# EAGLE schematic BrushlessMotorControllerL293D (EAGLE 9.6.2)
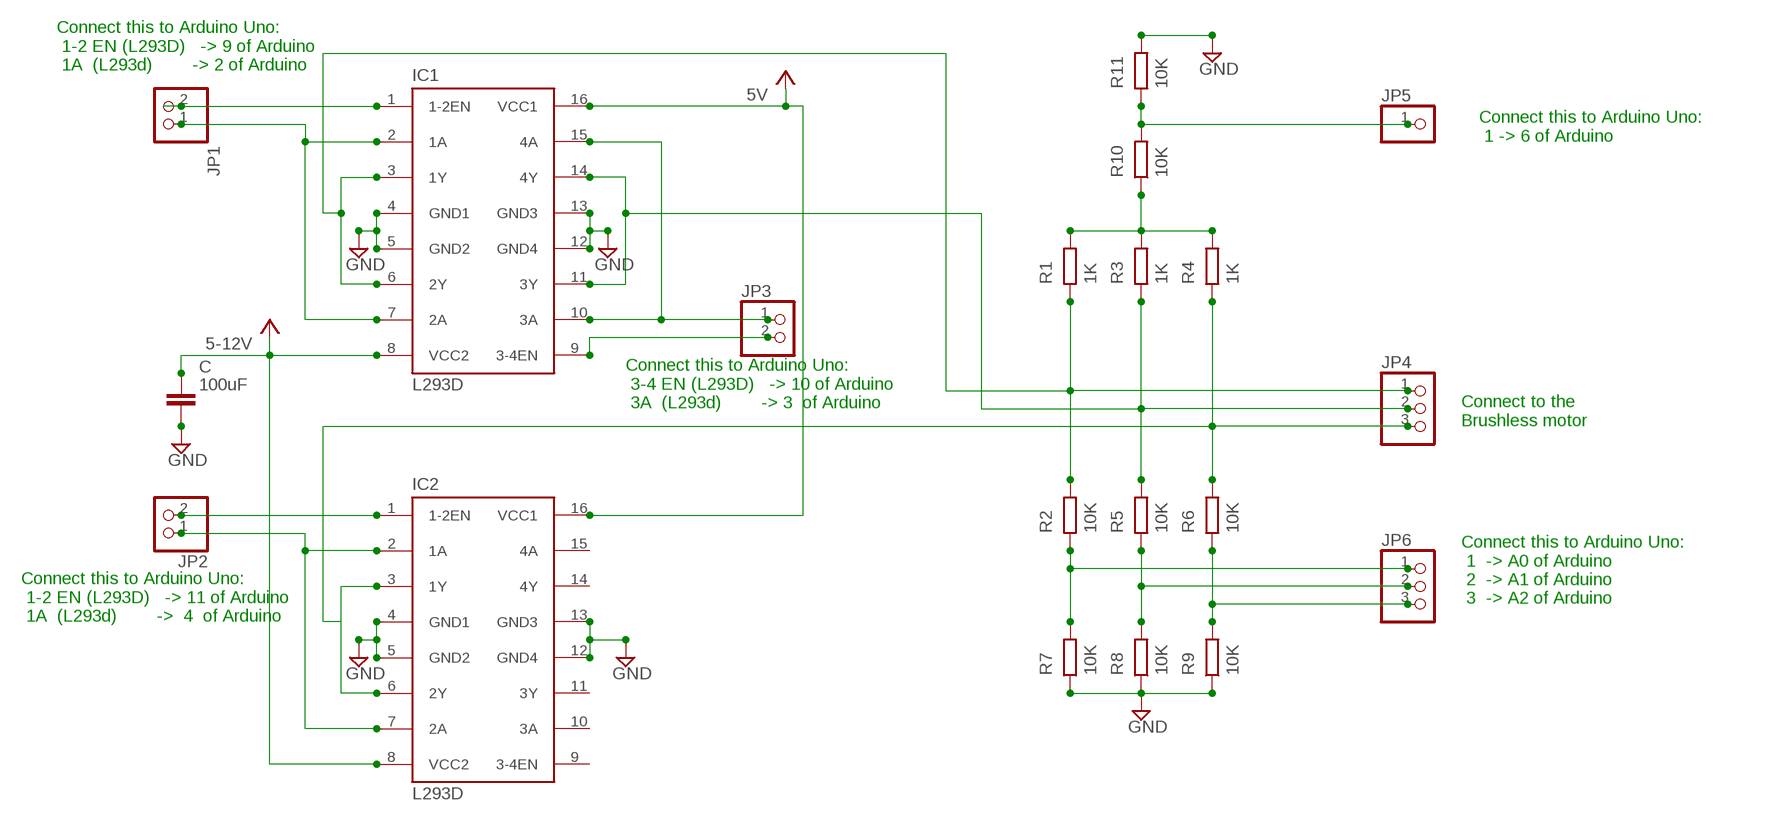
[diagram p0: schematic, sheet 1]

## Parts
C  100uF  C  (no package)
IC1  L293D  [DIL16]
IC2  L293D  [DIL16]
JP1  PINHD-1X2/90  [1X02/90]
JP2  PINHD-1X2/90  [1X02/90]
JP3  PINHD-1X2/90  [1X02/90]
JP4  PINHD-1X3/90  [1X03/90]
JP5  PINHD-1X1  [1X01]
JP6  PINHD-1X3/90  [1X03/90]
R1  1K  R  (no package)
R2  10K  R  (no package)
R3  1K  R  (no package)
R4  1K  R  (no package)
R5  10K  R  (no package)
R6  10K  R  (no package)
R7  10K  R  (no package)
R8  10K  R  (no package)
R9  10K  R  (no package)
R10  10K  R  (no package)
R11  10K  R  (no package)

## Nets
GND: C.2 IC1.4(GND1) IC1.5(GND2) IC1.12(GND4) IC1.13(GND3) IC2.4(GND1) IC2.5(GND2) IC2.12(GND4) IC2.13(GND3) R7.1 R8.1 R9.1 R11.2
N$7: IC1.3(1Y) IC1.6(2Y) JP4.1 R1.1 R2.2
N$8: IC1.2(1A) IC1.7(2A) JP1.1
N$9: IC1.11(3Y) IC1.14(4Y) JP4.2 R3.1 R5.2
N$10: IC1.10(3A) IC1.15(4A) JP3.1
N$11: IC2.3(1Y) IC2.6(2Y) JP4.3 R4.1 R6.2
N$12: IC2.2(1A) IC2.7(2A) JP2.1
N$13: IC1.9(3-4EN) JP3.2
N$14: IC1.1(1-2EN) JP1.2
N$15: IC2.1(1-2EN) JP2.2
N$16: R1.2 R3.2 R4.2 R10.1
N$21: JP6.1 R2.1 R7.2
N$22: JP6.2 R5.1 R8.2
N$23: JP6.3 R6.1 R9.2
N$24: JP5.1 R10.2 R11.1
VCC: C.1 IC1.8(VCC2) IC1.16(VCC1) IC2.8(VCC2) IC2.16(VCC1) ; supply symbol labelled 5-12V, 5V
Unconnected: IC2.9(3-4EN) IC2.10(3A) IC2.11(3Y) IC2.14(4Y) IC2.15(4A)

## Notes on the sheet
- Connect this to Arduino Uno:
   1-2 EN (L293D)   -> 9 of Arduino
   1A  (L293d)        -> 2 of Arduino
- Connect this to Arduino Uno:
   1 -> 6 of Arduino
- Connect this to Arduino Uno:
   3-4 EN (L293D)   -> 10 of Arduino
   3A  (L293d)        -> 3  of Arduino
- Connect to the
  Brushless motor
- Connect this to Arduino Uno:
   1  -> A0 of Arduino
   2  -> A1 of Arduino
   3  -> A2 of Arduino
- Connect this to Arduino Uno:
   1-2 EN (L293D)   -> 11 of Arduino
   1A  (L293d)        ->  4  of Arduino

## Library data of the parts
C = ngspice-simulation:C: CAPACITOR
IC1 IC2 = st-microelectronics:L293D: PUSH-PULL 4 CHANNEL DRIVER; MPN: L293D; OC_FARNELL: 9589619; OC_NEWARK: 56P8249
JP1-JP3 = pinhead:PINHD-1X2: PIN HEADER
JP4 JP6 = pinhead:PINHD-1X3: PIN HEADER
JP5 = pinhead:PINHD-1X1: PIN HEADER
R1-R11 = ngspice-simulation:R: RESISTOR